# EAGLE board csa-ultrabus-1.0a (EAGLE 6.4), part 1 of 2
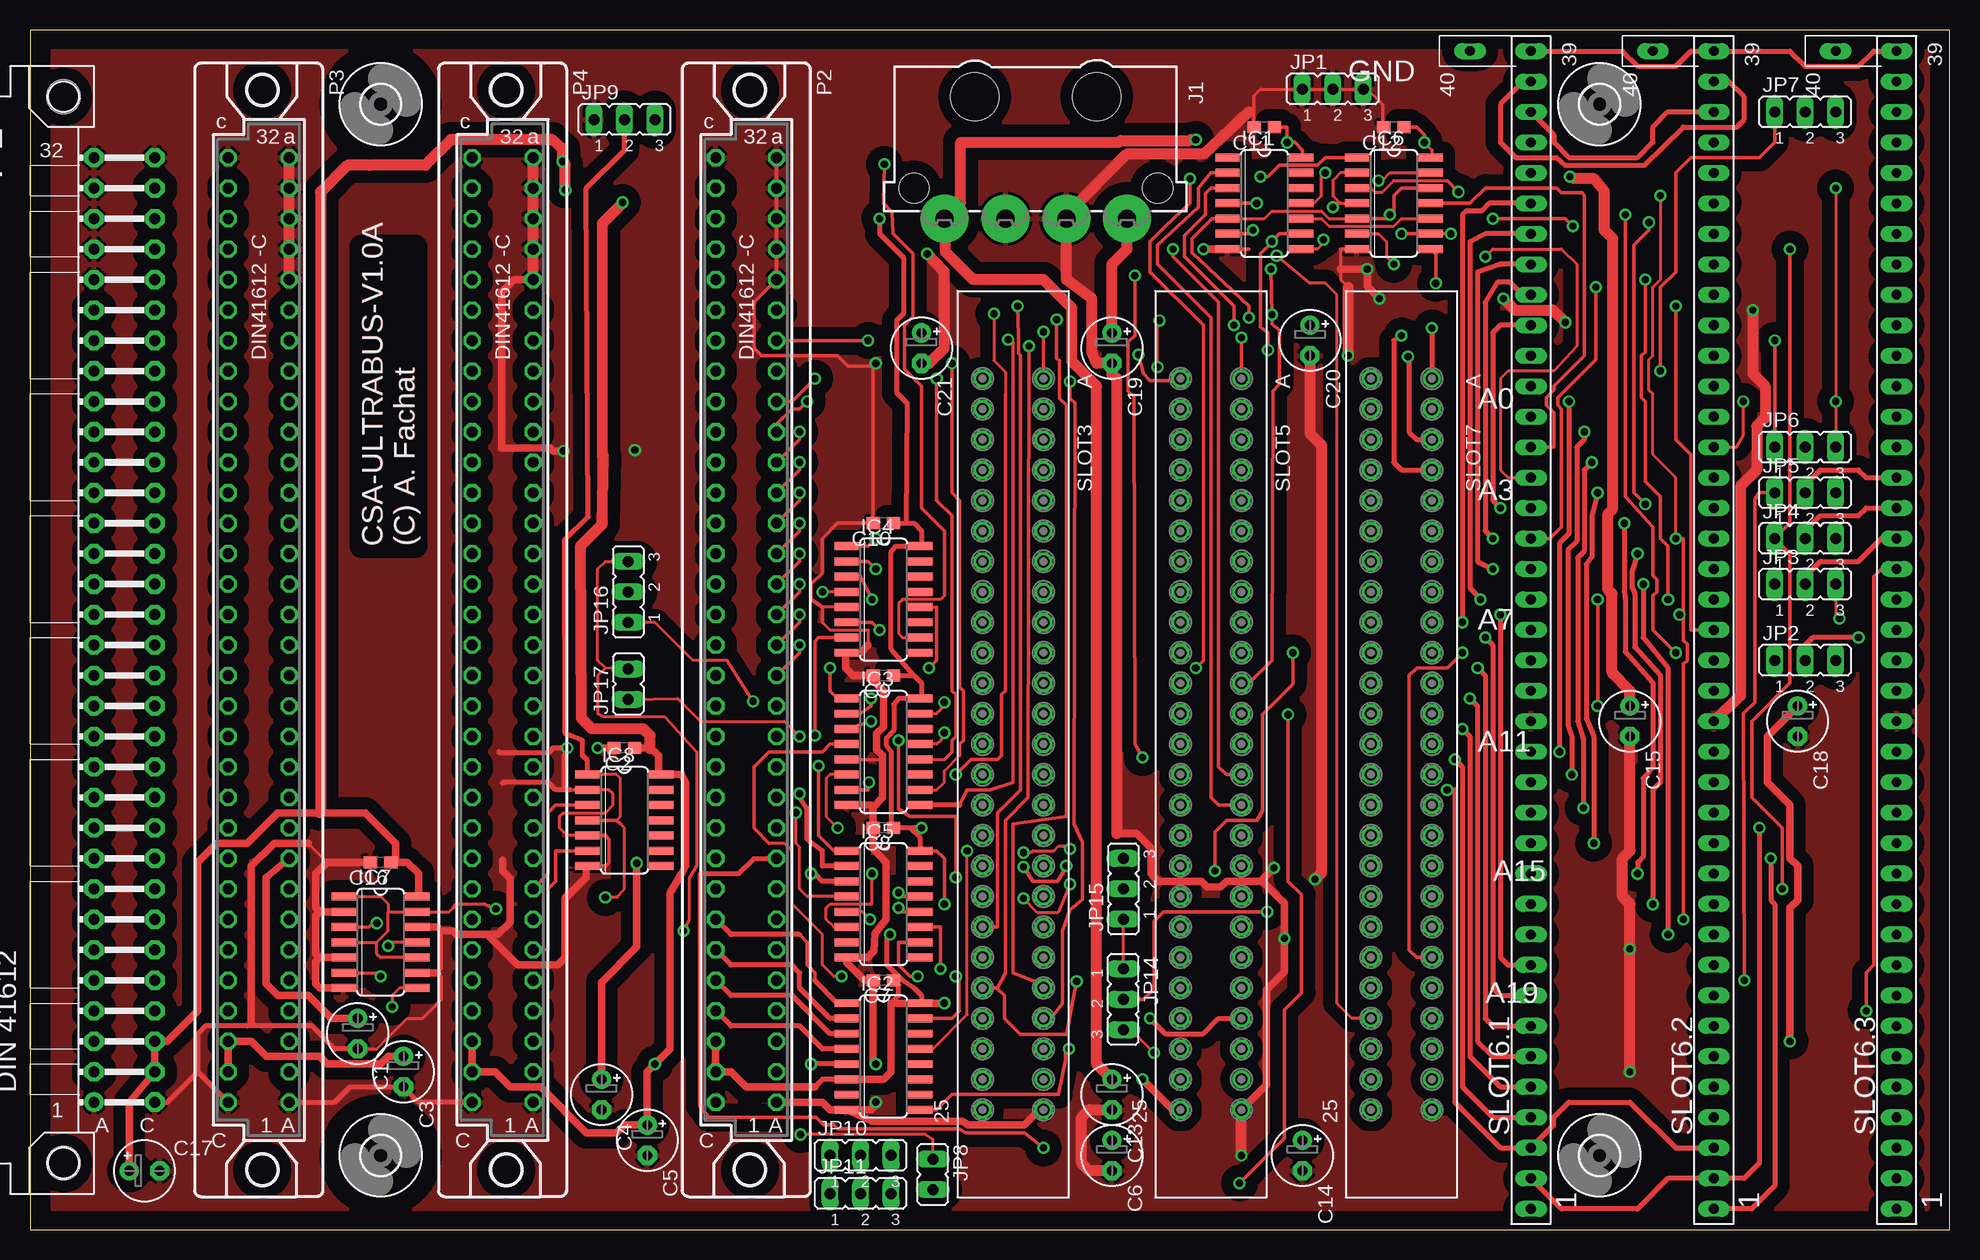
[diagram p3: board, top side]
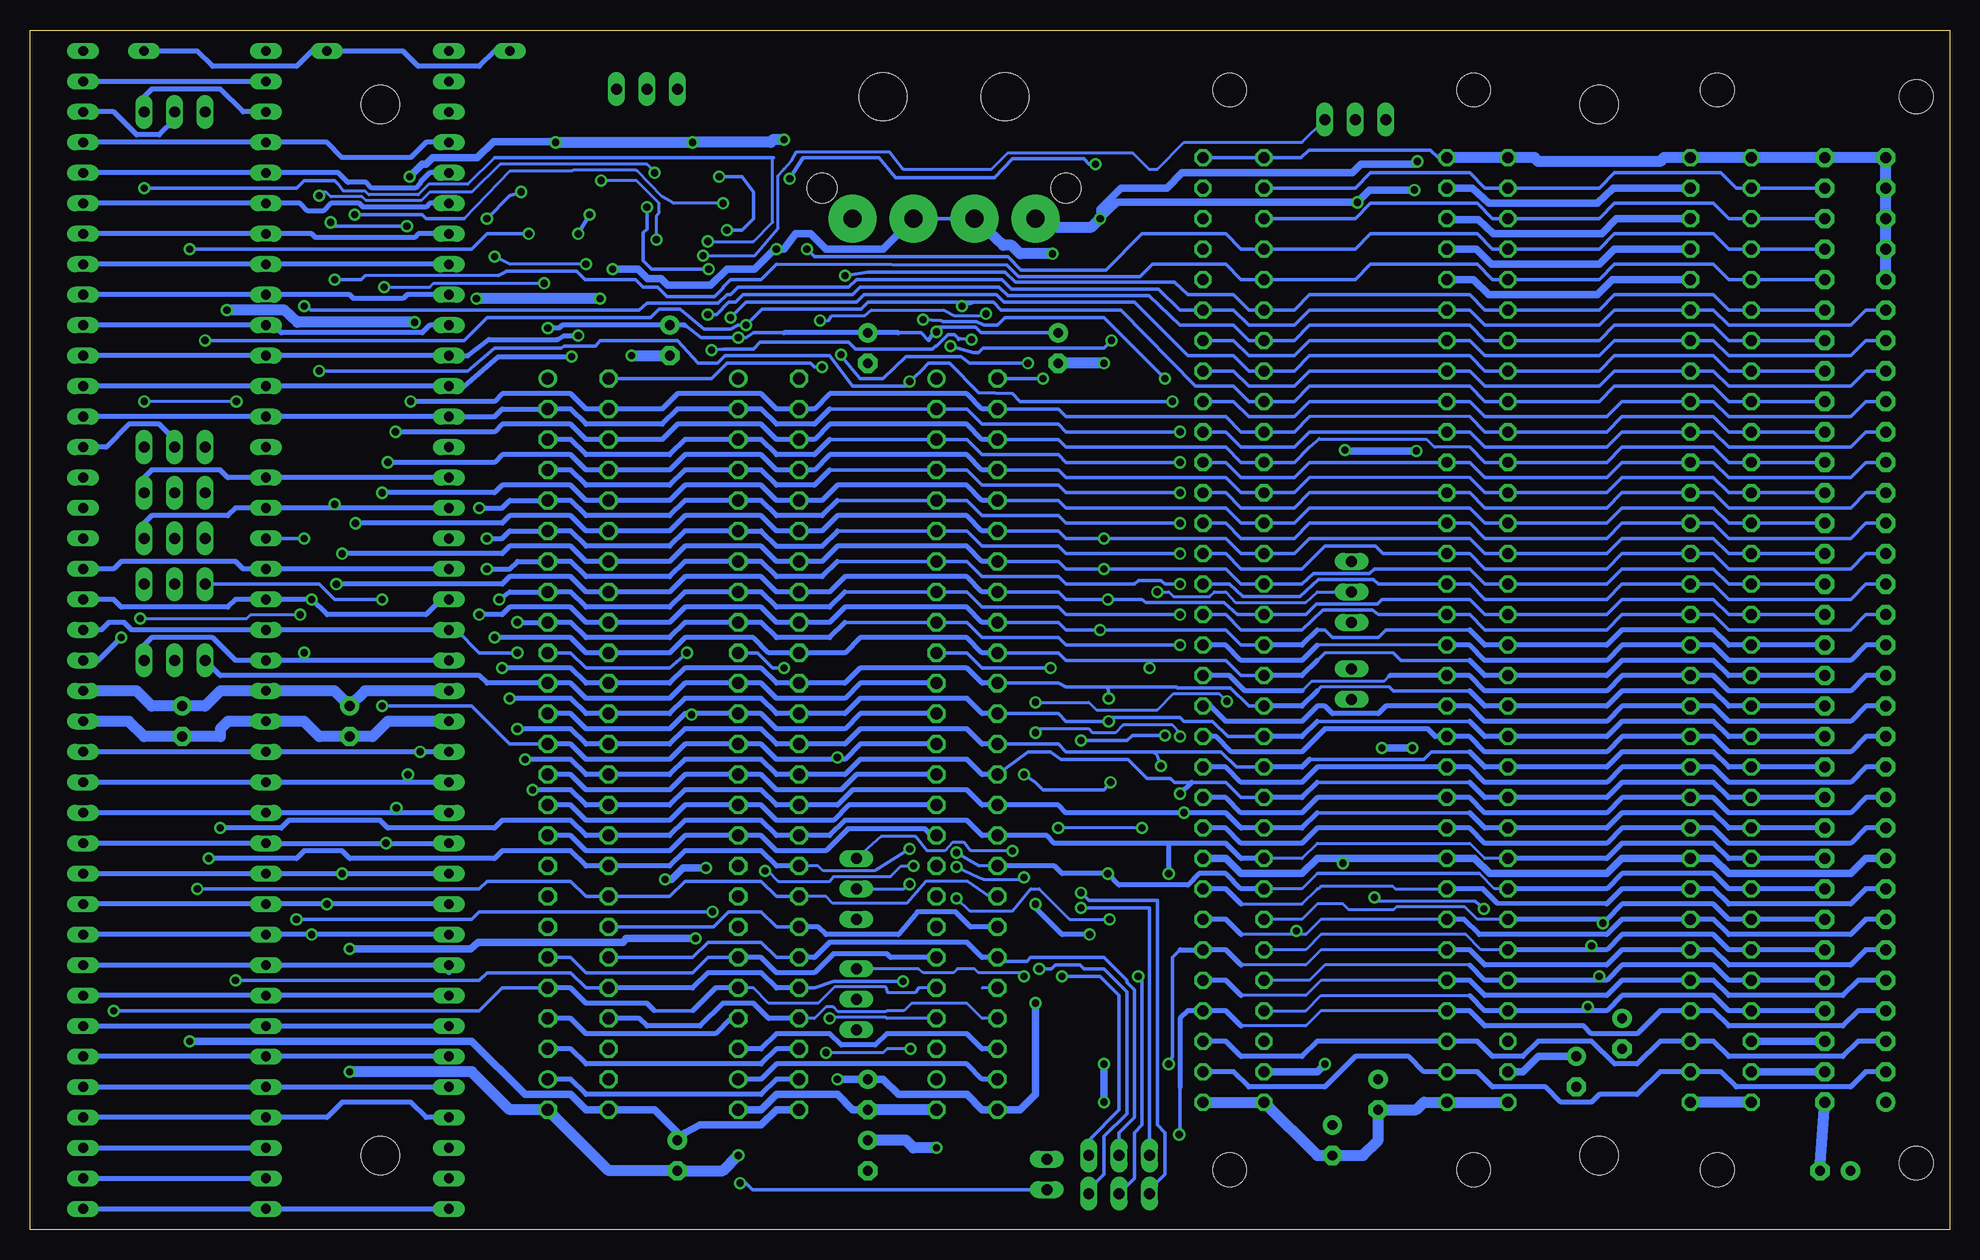
[diagram p4: board, bottom side, seen from below]

Size 160.02 x 100.03 mm. Coordinates in mm from the lower left corner, seen from the top.
Outline: 0.02,0.01 160.02,0.01 160.02,100.01 0.02,100.01 0.02,0.01
Copper layers (1*16): Top 0.035mm / dielectric 1.5mm / Bottom 0.035mm
Design rules "default *": minimum track width 10mil, minimum drill 20mil, track to track 6mil, track to pad 6mil, pad to pad 6mil, via to via 6mil, smd to smd 6mil, copper to edge 40mil, drill to drill 8mil, minimum pad ring 10mil, minimum via ring 8mil, stop-mask expansion 4mil, vias tented up to drill 0mil, thermal gap 10mil

## Footprints (pad centres in the part's own frame; a part is rotated, then mirrored left to right if it is on the bottom)
E2,5-5 = drill 0.813 pad 1.6: + -1.27,0 | drill 0.813 pad 1.6 octagon: - 1.27,0
C0603 = smd 1.1 x 1: 1 -0.85,0; 2 0.85,0
3,2 = hole 3.2: 0,0
SO14 = smd 0.66 x 2.032: 1 -3.81,-3.073; 2 -2.54,-3.073; 3 -1.27,-3.073; 4 0,-3.073; 5 1.27,-3.073; 6 2.54,-3.073; 7 3.81,-3.073; 8 3.81,3.073; 9 2.54,3.073; 10 1.27,3.073; 11 0,3.073; 12 -1.27,3.073; 13 -2.54,3.073; 14 -3.81,3.073
SO16 = smd 0.66 x 2.032: 1 -4.445,-3.073; 2 -3.175,-3.073; 3 -1.905,-3.073; 4 -0.635,-3.073; 5 0.635,-3.073; 6 1.905,-3.073; 7 3.175,-3.073; 8 4.445,-3.073; 9 4.445,3.073; 10 3.175,3.073; 11 1.905,3.073; 12 0.635,3.073; 13 -0.635,3.073; 14 -1.905,3.073; 15 -3.175,3.073; 16 -4.445,3.073
827001 = drill 1.5 pad 4: 1 -7.62,0; 2 -2.54,0; 3 2.54,0; 4 7.62,0 | hole 4: 5.08,-10.16; -5.08,-10.16 | hole 2.5: 10.16,-2.54; -10.16,-2.54
JP2 = drill 0.914 long: 1 -2.54,0; 2 0,0; 3 2.54,0
JP1 = drill 0.914 long: 1 0,-1.27; 2 0,1.27
CSABUS = drill 0.914 pad 1.6: A1 7.62,36.83 | drill 0.914 pad 1.6 octagon: A2 7.62,34.29; A3 7.62,31.75; A4 7.62,29.21; A5 7.62,26.67; A6 7.62,24.13; A7 7.62,21.59; A8 7.62,19.05; A9 7.62,16.51; A10 7.62,13.97; A11 7.62,11.43; A12 7.62,8.89; A13 7.62,6.35; A14 7.62,3.81; A15 7.62,1.27; A16 7.62,-1.27; A17 7.62,-3.81; A18 7.62,-6.35; A19 7.62,-8.89; A20 7.62,-11.43; A21 7.62,-13.97; A22 7.62,-16.51; A23 7.62,-19.05; A24 7.62,-21.59; A25 7.62,-24.13; A26 7.62,-26.67; A27 7.62,-29.21; A28 7.62,-31.75; A29 7.62,-34.29; A30 7.62,-36.83; A31 7.62,-39.37; A32 7.62,-41.91; C1 2.54,36.83; C2 2.54,34.29; C3 2.54,31.75; C4 2.54,29.21; C5 2.54,26.67; C6 2.54,24.13; C7 2.54,21.59; C8 2.54,19.05; C9 2.54,16.51; C10 2.54,13.97; C11 2.54,11.43; C12 2.54,8.89; C13 2.54,6.35; C14 2.54,3.81; C15 2.54,1.27; C16 2.54,-1.27; C17 2.54,-3.81; C18 2.54,-6.35; C19 2.54,-8.89; C20 2.54,-11.43; C21 2.54,-13.97; C22 2.54,-16.51; C23 2.54,-19.05; C24 2.54,-21.59; C25 2.54,-24.13; C26 2.54,-26.67; C27 2.54,-29.21; C28 2.54,-31.75; C29 2.54,-34.29; C30 2.54,-36.83; C31 2.54,-39.37; C32 2.54,-41.91 | hole 2.794: 10.16,41.91; 10.16,-46.99
CSABUSSOCK180 = drill 0.914 octagon: A1 -2.54,41.91; A2 -2.54,39.37; A3 -2.54,36.83; A4 -2.54,34.29; A5 -2.54,31.75; A6 -2.54,29.21; A7 -2.54,26.67; A8 -2.54,24.13; A9 -2.54,21.59; A10 -2.54,19.05; A11 -2.54,16.51; A12 -2.54,13.97; A13 -2.54,11.43; A14 -2.54,8.89; A15 -2.54,6.35; A16 -2.54,3.81; A17 -2.54,1.27; A18 -2.54,-1.27; A19 -2.54,-3.81; A20 -2.54,-6.35; A21 -2.54,-8.89; A22 -2.54,-11.43; A23 -2.54,-13.97; A24 -2.54,-16.51; A25 -2.54,-19.05; A26 -2.54,-21.59; A27 -2.54,-24.13; A28 -2.54,-26.67; A29 -2.54,-29.21; A30 -2.54,-31.75; A31 -2.54,-34.29; A32 -2.54,-36.83; C1 2.54,41.91; C2 2.54,39.37; C3 2.54,36.83; C4 2.54,34.29; C5 2.54,31.75; C6 2.54,29.21; C7 2.54,26.67; C8 2.54,24.13; C9 2.54,21.59; C10 2.54,19.05; C11 2.54,16.51; C12 2.54,13.97; C13 2.54,11.43; C14 2.54,8.89; C15 2.54,6.35; C16 2.54,3.81; C17 2.54,1.27; C18 2.54,-1.27; C19 2.54,-3.81; C20 2.54,-6.35; C21 2.54,-8.89; C22 2.54,-11.43; C23 2.54,-13.97; C24 2.54,-16.51; C25 2.54,-19.05; C26 2.54,-21.59; C27 2.54,-24.13; C28 2.54,-26.67; C29 2.54,-29.21; C30 2.54,-31.75; C31 2.54,-34.29; C32 2.54,-36.83 | hole 2.794: -0.305,47.549; -0.305,-42.469
FE100-25 = drill 1 octagon: 1 -29.21,-2.54; 2 -26.67,-2.54; 3 -24.13,-2.54; 4 -21.59,-2.54; 5 -19.05,-2.54; 6 -16.51,-2.54; 7 -13.97,-2.54; 8 -11.43,-2.54; 9 -8.89,-2.54; 10 -6.35,-2.54; 11 -3.81,-2.54; 12 -1.27,-2.54; 13 1.27,-2.54; 14 3.81,-2.54; 15 6.35,-2.54; 16 8.89,-2.54; 17 11.43,-2.54; 18 13.97,-2.54; 19 16.51,-2.54; 20 19.05,-2.54; 21 21.59,-2.54; 22 24.13,-2.54; 23 26.67,-2.54; 24 29.21,-2.54; 25 31.75,-2.54; B -26.67,2.54; C -24.13,2.54; D -21.59,2.54; E -19.05,2.54; F -16.51,2.54; G -13.97,2.54; H -11.43,2.54; J -8.89,2.54; K -6.35,2.54; L -3.81,2.54; M -1.27,2.54; N 1.27,2.54; O 3.81,2.54; P 6.35,2.54; Q 8.89,2.54; R 11.43,2.54; S 13.97,2.54; T 16.51,2.54; U 19.05,2.54; V 21.59,2.54; W 24.13,2.54; X 26.67,2.54; Z 31.75,2.54 | drill 1: A -29.21,2.54; Y 29.21,2.54
SIL39+1R = drill 0.813 long: 1 -21.59,0; 2 -19.05,0; 3 -16.51,0; 4 -13.97,0; 5 -11.43,0; 6 -8.89,0; 7 -6.35,0; 8 -3.81,0; 9 -1.27,0; 10 1.27,0; 11 3.81,0; 12 6.35,0; 13 8.89,0; 14 11.43,0; 15 13.97,0; 16 16.51,0; 17 19.05,0; 18 21.59,0; 19 24.13,0; 20 26.67,0; 21 29.21,0; 22 31.75,0; 23 34.29,0; 24 36.83,0; 25 39.37,0; 26 41.91,0; 27 44.45,0; 28 46.99,0; 29 49.53,0; 30 52.07,0; 31 54.61,0; 32 57.15,0; 33 59.69,0; 34 62.23,0; 35 64.77,0; 36 67.31,0; 37 69.85,0; 38 72.39,0; 39 74.93,0; 40 74.93,5.08

## Placement (x,y rotation side)
C1  47u  [E2,5-5]  27.32,16.36 270 top
C2  [C0603]  49.55,40.17 180 top
C3  47u  [E2,5-5]  31.13,13.18 270 top
C4  47u  [E2,5-5]  47.64,11.28 270 top
C5  47u  [E2,5-5]  51.45,7.47 270 top
C6  47u  [E2,5-5]  90.19,6.2 270 top
C7  [C0603]  71.14,20.8 180 top
C8  [C0603]  71.14,33.5 180 top
C9  [C0603]  71.14,46.2 180 top
C10  [C0603]  71.14,58.9 180 top
C11  [C0603]  102.89,91.92 180 top
C12  [C0603]  113.68,91.92 180 top
C13  47u  [E2,5-5]  90.19,11.28 270 top
C14  47u  [E2,5-5]  106.06,6.2 270 top
C15  47u  [E2,5-5]  133.37,42.39 270 top
C16  [C0603]  29.23,30.65 180 top
C17  47u  [E2,5-5]  9.54,4.93 0 top
C18  47u  [E2,5-5]  147.34,42.39 270 top
C19  47u  [E2,5-5]  90.19,73.51 270 top
C20  47u  [E2,5-5]  106.7,74.14 270 top
C21  47u  [E2,5-5]  74.31,73.51 270 top
H1  MOUNT-HOLE3.2  [3,2]  29.23,93.83 0 top
H2  MOUNT-HOLE3.2  [3,2]  29.23,6.2 0 top
H3  MOUNT-HOLE3.2  [3,2]  130.83,93.83 0 top
H4  MOUNT-HOLE3.2  [3,2]  130.83,6.2 0 top
IC1  74AC04D  [SO14]  102.89,85.57 270 top
IC2  74AC138D  [SO16]  71.14,14.45 270 top
IC3  74AC138D  [SO16]  71.14,39.85 270 top
IC4  74AC138D  [SO16]  71.14,52.55 270 top
IC5  74AC138D  [SO16]  71.14,27.15 270 top
IC6  74HCT00D  [SO14]  113.68,85.57 270 top
IC7  74HCT125D  [SO14]  29.23,23.98 270 top
IC8  74HCT125D  [SO14]  49.55,34.14 270 top
J1  [827001]  83.84,84.3 180 top
JP1  [JP2]  108.6,95.1 0 top
JP2  [JP2]  147.97,47.47 0 top
JP3  [JP2]  147.97,53.82 0 top
JP4  [JP2]  147.97,57.63 0 top
JP5  [JP2]  147.97,61.44 0 top
JP6  [JP2]  147.97,65.25 0 top
JP7  [JP2]  147.97,93.19 0 top
JP8  [JP1]  75.26,4.61 180 top
JP9  [JP2]  49.55,92.56 0 top
JP10  [JP2]  69.23,6.2 0 top
JP11  [JP2]  69.23,3.02 0 top
JP14  [JP2]  91.14,19.22 270 top
JP15  [JP2]  91.14,28.42 90 top
JP16  [JP2]  49.86,53.19 90 top
JP17  [JP1]  49.86,45.49 0 top
P1  CSABUS  [CSABUS]  12.95,47.47 180 top
P2  CSABUSSOCK180  [CSABUSSOCK180]  59.71,52.55 180 top
P3  CSABUSSOCK180  [CSABUSSOCK180]  19.07,52.55 180 top
P4  CSABUSSOCK180  [CSABUSSOCK180]  39.39,52.55 180 top
SLOT3  A2SLOT  [FE100-25]  81.93,41.76 270 top
SLOT5  A2SLOT  [FE100-25]  98.44,41.76 270 top
SLOT6.1  RC2014/650239+1R  [SIL39+1R]  125.11,23.34 90 top
SLOT6.2  RC2014/650239+1R  [SIL39+1R]  140.35,23.34 90 top
SLOT6.3  RC2014/650239+1R  [SIL39+1R]  155.59,23.34 90 top
SLOT7  A2SLOT  [FE100-25]  114.32,41.76 270 top

## Tracks (layer width: path | path; a pad name or v marks a point on that pad's centre or on a via)
8MHZ
  Top 0.305: IC1.2 98.44,88.11 97.41,86.84 97.41,85.25 94,82.08 94,80.49 98.44,76.05 98.44,36.04 99.08,35.41 SLOT5.P
  Bottom 0.406: SLOT3.P 91.77,35.41 93.04,34.14 97.81,34.14 99.08,35.41 SLOT5.P 105.43,35.41 106.7,34.14 113.68,34.14 114.95,35.41 SLOT7.P
8PHI2
  Bottom 0.305: P1.C31 P3.C31 17.8,86.84 19.07,88.11 27.96,88.11 29.23,86.84 P4.C31 38.75,86.84 40.02,88.11 48.28,88.11 49.55,86.84 P2.C31
12V  (via drill 0.6)
  Top 0.305: v100.98,74.38 SLOT5.A | SLOT3.A v84.47,74.86
  Top 0.406: v116.86,75.17 SLOT7.A
  Top 0.914: C19.+ 90.19,80.49 91.46,81.76 J1.1
  Bottom 0.305: C21.+ 80.74,74.78 81.22,75.25 84.47,75.25 | 97.17,74.78 99.71,74.78 100.35,74.38 v100.98,74.38 104.08,74.38 105.43,75.41 | 84.47,75.25 85.11,74.14 85.74,74.78 87.65,74.78 | v84.47,74.86 84.47,75.25
  Bottom 0.406: 87.65,74.78 C19.+ 97.17,74.78 | 105.43,75.41 C20.+ 115.66,75.41 115.9,75.17 v116.86,75.17
16MHZ
  Bottom 0.305: P1.C30 P3.C30 18.43,84.3 19.7,85.57 27.96,85.57 29.23,84.3 P4.C30 38.12,84.3 39.39,85.57 48.28,85.57 49.55,84.3 P2.C30
50HZ
  Bottom 0.406: P1.A3 7.64,15.72 8.91,14.45 18.43,14.45 19.7,15.72 P3.A3 24.15,15.72 26.05,13.82 27.96,13.82 29.86,15.72 34.31,15.72 35.58,14.45 38.12,14.45 39.39,15.72 P4.A3 52.72,15.72 53.99,14.45 59.07,14.45 60.34,15.72 P2.A3
/BANK0  (via drill 0.6)
  Top 0.254: 77.49,18.26 77.49,20.8 v77.17,21.12 | JP14.1 JP15.1
  Top 0.305: IC2.15 76.85,17.63 77.49,18.26
  Bottom 0.254: v77.17,21.12 77.49,21.44 80.98,21.44 81.3,21.76 82.72,21.76 83.04,21.44 85.58,21.44 85.98,21.76 JP14.1
/BANK2  (via drill 0.6)
  Top 0.254: IC2.13 75.26,15.09 78.12,17.94 v78.12,31.6
  Bottom 0.254: v78.12,31.6 81.61,31.6 82.17,32.31 83.12,32.31 83.76,31.6 85.26,31.6 86.22,32.79 89.07,32.79 90.19,31.84 JP15.3
/BANK4_Q  (via drill 0.6)
  Top 0.305: SLOT6.1.23 126.7,57.63 127.65,58.58 127.65,68.43 127.33,68.75 127.33,69.38 130.51,72.56 v130.51,78.59 | v117.17,78.9 117.17,81.34 IC6.8
  Bottom 0.254: v130.51,78.59 126.7,78.59 126.38,78.9 v117.17,78.9
/BANK6  (via drill 0.6)
  Top 0.254: v93.68,14.77 91.77,16.67 JP14.3
  Top 0.305: IC2.9 75.58,10.01 76.85,11.28 85.74,11.28 86.3,14.13 86.3,14.77 v86.61,15.09
  Bottom 0.254: v86.61,15.09 88.6,15.09 88.92,14.77 v93.68,14.77
/BE
  Top 0.305: P4.A8 43.2,29.69 43.2,34.77 43.83,35.41 IC8.3
  Bottom 0.254: 59.07,27.15 53.99,27.15 52.72,28.42 52.56,28.5 52.4,28.66 46.45,28.66 46.21,28.42 P4.A8
  Bottom 0.406: P1.A8 7,28.42 8.27,27.15 18.43,27.15 19.7,28.42 P3.A8 27.32,28.42 28.59,27.15 37.72,27.23 38.91,28.42 P4.A8 | 59.07,27.15 60.34,28.42 P2.A8
/DMA  (via drill 0.6)
  Top 0.254: SLOT7.22 110.19,17.63 108.92,18.9 108.92,77.95 107.97,78.9 106.7,78.9 v103.92,81.21
  Bottom 0.254: SLOT3.22 80.66,17.63 81.93,18.9 86.53,18.9 87.17,18.26 88.6,18.26 88.68,18.18 92.65,18.18 93.04,18.58 93.68,18.58 94.63,17.63 SLOT5.22 | v103.92,81.21 99.63,81.21 97.65,83.51 97.65,87.87 97.17,88.43 96.54,89.14 96.14,89.86 88.36,89.86 87.25,88.43 79.87,88.43 78.52,89.78 68.12,89.78 66.77,88.43 66.06,88.43 63.83,90.65 53.99,90.65 JP9.3
  Bottom 0.406: SLOT5.22 98.44,17.63 99.71,18.9 102.25,18.9 104.16,16.99 108.6,16.99 109.24,17.63 SLOT7.22
/EXTIO
  Bottom 0.254: P4.A5 52.4,20.8 53.67,19.53 59.07,19.53
  Bottom 0.406: P1.A5 7.64,20.8 8.91,19.53 18.43,19.53 19.7,20.8 P3.A5 27.32,20.8 28.59,19.53 38.75,19.53 40.02,20.8 P4.A5 | 59.07,19.53 60.34,20.8 P2.A5
/IOINH  (via drill 0.6)
  Top 0.254: JP8.1 75.26,7.55 74.63,7.94 v64.23,7.94
  Bottom 0.254: P4.A4 52.4,18.26 53.67,16.99 59.07,16.99 | v64.23,7.94 64.31,7.86 64.15,7.71
  Bottom 0.305: 64.15,11.91 64.15,7.71
  Bottom 0.406: P1.A4 7.64,18.26 8.91,16.99 18.43,16.99 19.7,18.26 P3.A4 24.15,18.26 26.05,16.36 29.86,16.36 30.5,16.99 38.75,16.99 40.02,18.26 P4.A4 | 59.07,16.99 60.34,18.26 P2.A4 63.52,18.26 64.15,17.63 64.15,11.91
/IOSEL  (via drill 0.6)
  Top 0.254: 47.96,46.84 47.32,47.47 47.32,55.09 47.96,55.73 JP16.3 | JP17.2 47.96,46.84 | 47.96,46.84 47.32,46.2 47.32,43.03 47.8,42.79 52.88,42.79 55.58,39.85 55.58,30.33 54.94,29.3 54.94,25.88 v54.47,24.93
  Bottom 0.254: P4.A7 52.4,25.88 53.67,24.61 54.55,24.61 | 54.55,24.61 59.07,24.61 | v54.47,24.93 54.55,24.61
  Bottom 0.406: P1.A7 7,25.88 8.27,24.61 18.43,24.61 19.7,25.88 P3.A7 27.32,25.88 28.59,24.61 39.23,24.61 40.5,25.88 P4.A7 | 59.07,24.61 60.34,25.88 P2.A7
/IOSTROBE
  Bottom 0.305: SLOT5.20 97.81,22.71 99.08,23.98 103.52,23.98 104.79,22.71 SLOT7.20 | JP10.2 69.23,8.1 67.96,9.37 67.96,20.01 68.6,20.64 68.6,20.8 70.5,22.71 76.61,22.71 76.93,22.39 79.07,22.39 SLOT3.20
  Bottom 0.406: SLOT3.20 80.66,22.71 81.93,23.98 93.36,23.98 94.63,22.71 SLOT5.20
/IRQ  (via drill 0.6)
  Top 0.305: SLOT3.V 85.11,20.17 81.93,21.44 81.93,33.82 86.38,34.45 86.38,68.75 85.82,69.3 85.82,72.48 85.58,72.63 v85.58,75.89 | P2.A24 63.52,69.06 v65.42,70.97 | v153.05,18.26 153.05,21.44 153.69,22.07 153.69,54.46 154.32,55.09 SLOT6.3.22
  Bottom 0.254: SLOT3.V 85.98,20.17 86.22,19.77 88.52,19.77 88.68,20.25 92.96,20.25 94.31,18.9 98.44,18.9 99.71,20.17 SLOT5.V
  Bottom 0.305: P1.A24 7,69.06 8.27,67.79 18.43,67.79 19.7,69.06 P3.A24 27.32,69.06 28.59,67.79 38.75,67.79 40.02,69.06 P4.A24 53.36,69.06 54.63,67.79 58.44,67.79 59.71,69.06 P2.A24 | 104.79,18.26 107.97,18.26 | v65.42,70.97 70.5,76.05 78.76,76.05 79.39,75.41 80.5,75.41 81.14,75.73 83.91,75.73 84.07,75.81 v85.58,75.89 | SLOT7.V 120.67,20.17 122.57,18.26 v153.05,18.26
  Bottom 0.406: SLOT5.V 102.89,20.17 104.79,18.26 | 107.97,18.26 108.6,18.9 113.68,18.9 114.95,20.17 SLOT7.V | SLOT6.1.22 SLOT6.2.22 142.26,55.09 142.89,55.73 152.42,55.73 153.05,55.09 SLOT6.3.22
/M1  (via drill 0.6)
  Top 0.305: IC1.4 v102.25,85.57 | v132.97,84.62 132.97,61.12 135.27,58.58 135.27,54.54 135.59,54.22 135.59,53.19 135.27,52.87 135.27,50.01 v137.18,48.11
  Bottom 0.254: v102.25,85.57 106.38,85.57 107.33,86.13 109.39,88.27 109.55,88.35 114.71,88.35 114.87,88.27 120.03,88.27 123.84,84.3
  Bottom 0.305: 123.84,84.3 127.02,84.3 127.33,84.62 v132.97,84.62 | v137.18,48.11 137.18,47.47
  Bottom 0.406: SLOT6.1.19 137.18,47.47 SLOT6.2.19 142.89,47.47 144.8,49.38 149.88,49.38 150.51,48.74 JP2.3
/MEMSEL  (via drill 0.6)
  Top 0.254: 43.2,23.34 P4.A6
  Top 0.305: 43.2,23.34 43.2,28.42 43.83,29.06 43.83,31.6 IC8.6
  Top 0.406: IC2.5 v65.1,13.82
  Bottom 0.254: P4.A6 52.4,23.34 53.67,22.07 59.07,22.07
  Bottom 0.305: 64.15,23.34 64.79,22.71 64.79,14.45 v65.1,13.82
  Bottom 0.406: P1.A6 7,23.34 8.27,22.07 18.43,22.07 19.7,23.34 P3.A6 27.32,23.34 28.59,22.07 38.75,22.07 40.02,23.34 P4.A6 | 59.07,22.07 60.34,23.34 P2.A6 64.15,23.34
/NMI  (via drill 0.6)
  Top 0.305: SLOT3.W 85.11,17.63 86.06,18.9 86.06,24.93 86.69,26.68 87.72,27.55 87.72,32.31 87.01,33.82 87.09,68.9 86.69,69.3 v86.69,70.73 | P2.A23 62.25,67.16 63.52,68.43 64.15,68.43 v64.79,69.06 | JP7.1 145.43,90.65 144.16,89.38 138.45,89.38 137.18,88.11 137.18,79.86 135.91,78.59 v135.91,71.6
  Top 0.406: v93.36,17.63 94.63,16.36 97.81,16.36 99.08,17.63 SLOT5.W
  Bottom 0.254: SLOT3.W 88.6,17.63 88.68,17.71 93.2,17.71 93.28,17.63 v93.36,17.63
  Bottom 0.305: P1.A23 7,66.52 8.27,65.25 18.43,65.25 19.7,66.52 P3.A23 27.32,66.52 28.59,65.25 38.75,65.25 40.02,66.52 P4.A23 53.36,66.52 54.63,65.25 59.07,65.25 60.34,66.52 P2.A23 | v64.79,69.06 77.49,69.06 78.12,69.7 80.98,69.78 83.36,72.24 85.11,72.24 85.74,71.6 v86.69,70.73 87.01,70.33 91.46,70.33 93.36,72.87 102.09,72.87 102.73,72.24 104.31,72.24 106.06,74.14 112.49,74.14 112.89,73.67 115.51,73.67 115.74,73.51 121.3,73.51 123.52,71.6 v135.91,71.6
  Bottom 0.406: SLOT5.W 101.62,17.63 102.89,16.36 113.68,16.36 114.95,17.63 SLOT7.W
/RD0  (via drill 0.6)
  Top 0.254: IC6.6 112.41,83.03 113.05,82.4 113.05,81.13 v113.68,80.49 | v121.3,81.13 121.94,81.76 127.65,81.76 128.92,80.49 128.92,73.67 127.02,71.6 123.21,71.6 122.57,70.97 122.57,63.35 123.21,62.71 SLOT6.1.25
  Bottom 0.254: v113.68,80.49 120.03,80.49 v121.3,81.13
  Bottom 0.406: SLOT6.1.25 SLOT6.2.25 143.53,62.71 144.16,63.35 149.88,63.35 150.51,62.71 JP5.3
/RES  (via drill 0.6)
  Top 0.305: v137.18,77 137.18,65.89 138.45,64.62 138.45,50.01 SLOT6.2.20 | SLOT7.U 115.59,22.71 114.95,23.34 114.95,46.2 115.59,46.84 118.13,46.84 v119.4,48.11
  Bottom 0.305: P1.A27 7,76.68 8.27,75.41 18.43,75.41 19.7,76.68 P3.A27 27.96,76.68 29.23,75.41 38.75,75.41 40.02,76.68 P4.A27 53.36,76.68 54.63,75.41 58.44,75.41 59.71,76.68 P2.A27 64.15,76.68 65.98,78.43 78.2,78.43 78.99,79.22 91.14,79.22 91.77,78.59 100.98,78.59 101.62,77.95 101.93,77.95 102.65,77.24 108.6,77.24 109.24,76.68 136.62,76.68 136.94,77 v137.18,77 | SLOT5.U 103.52,22.71 104.79,21.44 113.68,21.44 114.95,22.71 SLOT7.U | v119.4,48.11 122.57,48.11 124.48,50.01 SLOT6.1.20
  Bottom 0.406: SLOT3.U 88.28,22.71 88.6,23.03 93.04,23.03 94.63,21.44 97.81,21.44 99.08,22.71 SLOT5.U | SLOT6.1.20 SLOT6.2.20 151.54,50.01 152.18,50.65 153.45,50.65 154.08,50.01 SLOT6.3.20
/SEL6  (via drill 0.6)
  Top 0.254: JP3.3 150.51,51.28 v150.83,50.97 | v137.49,51.28 137.81,51.28 | v137.18,57.63 137.18,62.71 135.27,64.62 135.27,69.7 134.95,70.01 134.95,72.56 135.27,72.87 135.27,78.59 135.91,79.22 v135.91,86.21 | IC1.11 107.01,85.57 107.65,86.21 107.65,87.79 v107.97,88.11
  Top 0.305: v103.12,26.52 94.47,26.52 93.68,25.72 93.68,20.09 92.8,19.22 JP14.2 | v137.81,25.88 137.81,47.15 138.13,47.47 138.13,48.82 137.81,49.14 137.81,51.28 137.81,57.63 v137.18,57.63
  Bottom 0.254: v150.83,50.97 141.94,50.97 141.62,51.28 v137.49,51.28 | v107.97,88.11 107.97,88.19 108.6,88.83 120.82,88.83 123.21,86.53 126.7,86.53 127.41,85.81 132.02,85.81 132.33,86.13 134.95,86.13 135.35,86.53 135.59,86.53 v135.91,86.21
  Bottom 0.305: v103.12,26.52 122.57,26.52 123.21,25.88 v137.81,25.88 | v137.18,57.63 SLOT6.2.23
/SLOT0IO  (via drill 0.6)
  Top 0.254: IC3.15 75.58,43.03 75.9,43.34 v76.22,43.98 | v60.26,44.06 58.12,47.47 55.26,47.47 52.09,50.65 JP16.1
  Bottom 0.254: v76.22,43.98 71.77,43.98 71.14,43.34 66.06,43.34 64.71,44.69 60.9,44.69 v60.26,44.06
/SLOT2IO  (via drill 0.6)
  Top 0.254: JP17.1 53.99,44.3 55.9,42.39 62.88,42.39 v64.15,41.12 | v76.22,41.44 75.9,40.8 75.58,40.49 IC3.13
  Bottom 0.254: v64.15,41.12 64.15,41.44 64.79,42.08 68.91,42.08 69.55,41.44 71.45,41.44 71.77,41.76 75.9,41.76 v76.22,41.44
/SLOT3IO  (via drill 0.6)
  Top 0.254: IC3.12 76.22,39.22
  Top 0.305: 76.22,39.22 76.85,39.85 76.85,40.8 77.17,41.12 77.17,44.62 76.85,44.93 76.85,59.54 75.58,60.81 v75.58,70.97
  Bottom 0.305: v75.58,70.97 SLOT3.1
/SLOT4IO_Q
  Top 0.305: IC6.11 120.03,85.57 121.3,86.84 127.25,86.84 127.65,86.45 129.4,86.45 129.56,86.21 129.56,72.87 127.02,70.33 127.02,70.01 126.38,69.38 126.38,68.75 127.02,68.11 127.02,65.25 SLOT6.1.26
/SLOT5IO  (via drill 0.6)
  Top 0.254: IC3.10 75.58,36.68 76.22,37.31 76.22,38.26 77.49,39.54
  Top 0.305: 77.49,39.54 77.49,40.49 77.8,40.8 77.8,44.93 77.49,45.25 77.49,60.81 76.85,61.44 v76.85,72.24 | v92.41,72.95 92.8,71.36 93.36,70.81 95.82,70.81 95.9,70.89 SLOT5.1
  Bottom 0.305: v76.85,72.24 81.69,72.24 82.41,72.79 87.01,72.79 88.92,70.97 90.82,70.97 92.09,72.48 v92.41,72.95
/SLOT6IO  (via drill 0.6)
  Top 0.254: SLOT6.2.26 142.26,65.25 142.81,66.2 v142.81,69.06 | JP6.3 v150.51,69.06 v150.51,86.84
  Top 0.305: 77.49,35.41 78.12,36.68 80.03,36.68 81.93,37.31 81.93,73.98 81.61,73.9 v81.53,74.22 | IC1.9 104.16,83.03 v103.52,82.4 103.6,82.32 103.6,82.4 102.57,81.37 102.57,75.25 103.2,74.78 v103.2,73.35
  Top 0.406: 77.49,35.41 IC3.9
  Bottom 0.254: 121.3,89.38 123.52,87.16 126.78,87.16 127.65,86.29 131.78,86.29 132.1,86.6 133.92,86.6 134.32,87.16 | v142.81,69.06 v150.51,69.06 | v103.52,82.4 99.71,82.4 98.12,83.98 98.12,89.38
  Bottom 0.305: 98.04,89.38 98.12,89.38 121.3,89.38 | 134.32,87.16 134.64,87.48 137.18,87.48 137.81,86.84 v150.51,86.84 | v81.53,74.22 82.49,74.3 82.64,74.22 82.64,74.3 82.96,74.62 83.52,74.62 84.47,73.67 84.55,73.67 84.79,73.43 91.22,73.43 91.77,73.98 99.15,73.98 99.71,73.43 102.17,73.43 v103.2,73.35
/SLOT7IO  (via drill 0.6)
  Top 0.254: v94,71.92 94,75.25 94.15,75.41 v94.15,75.81 | v80.34,76.36 80.34,72.48 81.3,71.52 81.3,69.7
  Top 0.305: IC3.7 69.87,36.68 v69.94,37.31 | v77.17,37.95 78.44,39.22 80.66,39.22 80.98,39.54 80.98,44.62 81.3,44.93 81.3,69.7
  Bottom 0.254: v94.15,75.81 93.44,75.81 93.2,76.21 90.42,76.21 89.87,76.68 83.84,76.68 82.96,76.21 80.9,76.21 v80.34,76.36
  Bottom 0.305: SLOT7.1 103.2,70.97 101.93,72.24 94.95,72.24 94.63,71.92 v94,71.92 | v69.94,37.31 70.5,36.68 75.58,36.68 76.22,37.31 v77.17,37.95
/SLOTIO  (via drill 0.6)
  Top 0.254: v67.64,21.12 67.01,21.12 66.06,22.07 66.06,24.61 63.52,27.15 63.52,31.6 62.88,32.23 61.61,32.23
  Top 0.305: 61.61,32.23 60.34,33.5 60.34,38.58 61.61,39.85 66.06,39.85 66.69,40.49 IC3.4
  Bottom 0.305: JP11.2 67.96,4.29 67.96,8.1 67.33,8.74 67.33,20.8 v67.64,21.12
/SO
  Bottom 0.305: P1.A25 7,71.6 8.27,70.33 18.43,70.33 19.7,71.6 P3.A25 27.96,71.6 29.23,70.33 38.75,70.33 40.02,71.6 P4.A25 53.36,71.6 54.63,70.33 58.44,70.33 59.71,71.6 P2.A25
/WR0  (via drill 0.6)
  Top 0.254: IC6.3 111.78,86.84 112.09,86.53 112.73,86.53 113.68,87.48 118.13,87.48
  Top 0.305: 118.13,87.48 v119.08,86.53 | v121.94,84.3 127.97,84.3 v128.6,83.67 | v134.95,83.98 134.95,83.35 133.68,82.08 133.68,61.44 v134.64,60.49
  Bottom 0.305: v119.08,86.53 120.03,86.21 v121.94,84.3 | v128.6,83.67 134.64,83.67 v134.95,83.98 | v134.64,60.49 134.64,60.17
  Bottom 0.406: SLOT6.1.24 134.64,60.17 SLOT6.2.24 142.89,60.17 143.53,59.54 149.88,59.54 150.51,58.9 JP4.3
A2USER1  (via drill 0.6)
  Top 0.305: v100.82,3.9 104.55,7.63 104.55,18.34 105.98,19.77 105.98,27.95 104.87,29.06 v104.87,42.95
  Bottom 0.305: JP8.2 99.79,3.34 100.35,3.9 v100.82,3.9 | v104.87,42.95 105.5,42.95 106.85,41.76
  Bottom 0.406: SLOT3.M 90.82,43.03 92.09,41.76 97.81,41.76 99.08,43.03 SLOT5.M 105.43,43.03 105.5,42.95 106.7,41.76 106.85,41.76 113.68,41.76 114.95,43.03 SLOT7.M
B2PHI2  (via drill 0.6)
  Top 0.305: v95.27,81.76 95.27,81.13 99.08,77.32 99.08,38.58 99.71,37.95 SLOT5.O
  Bottom 0.305: P1.C29 P3.C29 18.43,81.76 19.7,83.03 27.96,83.03 29.23,81.76 P4.C29 38.12,81.76 39.39,83.03 48.28,83.03 49.55,81.76 P2.C29 59.07,81.76 60.34,83.03 67.33,83.03 70.34,80.02 77.41,80.02 78.52,81.13 94.63,81.13 v95.27,81.76
  Bottom 0.406: SLOT3.O 91.14,37.95 92.41,36.68 97.81,36.68 99.08,37.95 SLOT5.O 105.43,37.95 106.7,36.68 113.68,36.68 114.95,37.95 SLOT7.O
BA0  (via drill 0.6)
  Top 0.406: v128.29,69.06 128.29,58.03 127.49,57.24 v127.49,39.85
  Bottom 0.254: 40.02,67.79 53.36,67.79
  Bottom 0.305: P1.C23 P3.C23 18.43,66.52 19.7,67.79 27.32,67.79 28.59,66.52 P4.C23 38.75,66.52 40.02,67.79 | 53.36,67.79 54.63,66.52 P2.C23 59.07,66.52 60.34,67.79 73.68,67.79 74.31,68.43 SLOT3.2
  Bottom 0.406: SLOT3.2 80.66,68.43 81.93,69.7 93.36,69.7 94.63,68.43 SLOT5.2 97.81,68.43 99.08,69.7 106.06,69.7 107.33,68.43 SLOT7.2 113.68,68.43 114.95,69.7 120.67,69.7 121.3,69.06 v128.29,69.06 | SLOT6.1.16 v127.49,39.85 SLOT6.2.16 SLOT6.3.16
BA1  (via drill 0.6)
  Top 0.406: v129.56,66.52 129.56,65.89 128.92,65.25 128.92,57.39 128.21,56.68 128.21,42.08 128.52,41.12 v128.52,37.95
  Bottom 0.254: 40.02,65.25 42.96,65.25 43.59,65.89 52.48,65.89 52.56,65.97 53.36,65.25
  Bottom 0.305: P1.C22 P3.C22 18.43,63.98 19.7,65.25 27.32,65.25 28.59,63.98 P4.C22 38.75,63.98 40.02,65.25 | 53.36,65.25 54.63,63.98 P2.C22 59.07,63.98 60.34,65.25 73.68,65.25 74.31,65.89 SLOT3.3
  Bottom 0.406: SLOT3.3 80.66,65.89 81.93,67.16 93.36,67.16 94.63,65.89 SLOT5.3 97.81,65.89 99.08,67.16 106.06,67.16 107.33,65.89 SLOT7.3 113.68,65.89 114.95,67.16 120.67,67.16 121.3,66.52 v129.56,66.52 | SLOT6.1.15 128.84,37.31 | 128.84,37.31 SLOT6.2.15 SLOT6.3.15 | v128.52,37.95 128.84,37.31
BA2  (via drill 0.6)
  Top 0.406: v130.19,63.98 129.56,63.35 129.56,56.6 129,56.04 129,42.39 129.48,40.88 v129.48,35.17
  Bottom 0.254: 40.02,62.71 53.36,62.71
  Bottom 0.305: P1.C21 P3.C21 18.43,61.44 19.7,62.71 27.32,62.71 28.59,61.44 P4.C21 38.75,61.44 40.02,62.71 | 53.36,62.71 54.63,61.44 P2.C21 59.07,61.44 60.34,62.71 73.68,62.71 74.31,63.35 SLOT3.4
  Bottom 0.406: SLOT3.4 80.66,63.35 81.93,64.62 93.36,64.62 94.63,63.35 SLOT5.4 97.81,63.35 99.08,64.62 105.43,64.62 106.7,63.35 SLOT7.4 113.68,63.35 114.95,64.62 120.67,64.62 121.3,63.98 v130.19,63.98 | SLOT6.1.14 129.95,34.77 | 129.95,34.77 SLOT6.2.14 SLOT6.3.14 | v129.48,35.17 129.95,34.77
BA3  (via drill 0.6)
  Top 0.406: v130.67,61.44 130.19,59.54 130.19,56.12 129.71,55.49 129.71,42.63 130.35,41.12 v130.35,32.23
  Bottom 0.305: P1.C20 P3.C20 18.43,58.9 19.7,60.17 27.32,60.17 28.59,58.9 P4.C20 38.75,58.9 40.02,60.17 53.36,60.17 54.63,58.9 P2.C20 59.07,58.9 60.34,60.17 73.68,60.17 74.31,60.81 SLOT3.5
  Bottom 0.406: SLOT3.5 80.66,60.81 81.93,62.08 92.73,62.08 94,60.81 SLOT5.5 97.81,60.81 99.08,62.08 105.43,62.08 106.7,60.81 SLOT7.5 113.68,60.81 114.95,62.08 120.67,62.08 121.3,61.44 v130.67,61.44 | SLOT6.1.13 v130.35,32.23 SLOT6.2.13 SLOT6.3.13
BA4  (via drill 0.6)
  Top 0.305: IC4.1 69.87,57 v70.5,57.63
  Top 0.406: v132.89,58.9 132.89,53.19 132.97,52.63 132.97,48.19 135.27,45.57 135.27,38.58 134.48,37.63 134.48,31.12 134,30.65 v134,29.69
  Bottom 0.305: P1.C19 P3.C19 18.43,56.36 19.7,57.63 27.32,57.63 28.59,56.36 P4.C19 38.75,56.36 40.02,57.63 53.36,57.63 54.63,56.36 P2.C19 59.07,56.36 60.34,57.63 v70.5,57.63 73.68,57.63 74.31,58.27 SLOT3.6
  Bottom 0.406: SLOT3.6 80.66,58.27 81.93,59.54 92.73,59.54 94,58.27 SLOT5.6 97.81,58.27 99.08,59.54 105.43,59.54 106.7,58.27 SLOT7.6 113.68,58.27 114.95,59.54 120.03,59.54 120.67,58.9 v132.89,58.9 | SLOT6.3.12 SLOT6.2.12 v134,29.69 SLOT6.1.12
BA5  (via drill 0.6)
  Top 0.305: IC4.2 69.87,55.73 v70.5,55.09
  Top 0.406: v134,56.36 133.52,54.85 133.52,53.58 133.76,53.03 133.76,48.58 135.91,46.2 135.91,37.31 135.27,36.68 v135.27,27.15
  Bottom 0.305: P1.C18 P3.C18 18.43,53.82 19.7,55.09 27.32,55.09 28.59,53.82 P4.C18 38.75,53.82 40.02,55.09 47.96,55.09 48.35,54.7 53.04,54.7 53.99,53.82 P2.C18 59.07,53.82 60.34,55.09 v70.5,55.09 73.68,55.09 74.31,55.73 SLOT3.7
  Bottom 0.406: SLOT3.7 80.66,55.73 81.93,57 92.73,57 94,55.73 SLOT5.7 97.81,55.73 99.08,57 105.43,57 106.7,55.73 SLOT7.7 113.68,55.73 114.95,57 120.03,57 120.67,56.36 v134,56.36 | SLOT6.1.11 v135.27,27.15 SLOT6.2.11 SLOT6.3.11
BA6  (via drill 0.6)
  Top 0.305: IC4.3 69.23,54.46 v70.18,52.55
  Top 0.406: v134.48,53.82 134.48,49.38 136.54,46.84 v136.54,24.61
  Bottom 0.305: P1.C17 P3.C17 18.43,51.28 19.7,52.55 27.32,52.55 28.59,51.28 P4.C17 38.75,51.28 40.02,52.55 47.32,52.55 47.72,52.16 52.8,52.16 53.67,51.28 P2.C17 59.39,51.28 60.5,52.31 67.01,52.31 67.33,52.55 v70.18,52.55 73.68,52.55 74.31,53.19 SLOT3.8
  Bottom 0.406: SLOT3.8 80.66,53.19 81.93,54.46 92.09,54.46 93.36,53.19 SLOT5.8 97.81,53.19 99.08,54.46 105.43,54.46 106.7,53.19 SLOT7.8 113.68,53.19 114.95,54.46 120.03,54.46 120.67,53.82 v134.48,53.82 | SLOT6.1.10 v136.54,24.61 SLOT6.2.10 SLOT6.3.10
BA7  (via drill 0.6)
  Top 0.305: IC4.6 70.18,50.65 v70.82,50.01
  Top 0.406: v122.57,51.28 122.57,22.71 123.21,22.07 SLOT6.1.9
  Bottom 0.305: P2.C16 59.07,48.74 60.34,50.01 v70.82,50.01 73.68,50.01 74.31,50.65 SLOT3.9 | 40.02,50.01 47.01,50.01 47.64,49.38 51.45,49.38 52.09,50.01 52.72,50.01
  Bottom 0.406: P1.C16 P3.C16 18.43,48.74 19.7,50.01 27.32,50.01 28.59,48.74 P4.C16 38.75,48.74 40.02,50.01 | 52.72,50.01 53.99,48.74 P2.C16 | SLOT3.9 80.66,50.65 81.93,51.92 92.09,51.92 93.36,50.65 SLOT5.9 97.81,50.65 99.08,51.92 105.43,51.92 106.7,50.65 SLOT7.9 113.68,50.65 114.95,51.92 120.03,51.92 120.67,51.28 v122.57,51.28 | SLOT6.3.9 SLOT6.2.9 125.75,22.07 125.11,21.44 124.48,22.07 SLOT6.1.9
BA8  (via drill 0.6)
  Top 0.305: IC3.1 67.33,44.3 66.69,44.93 v66.69,46.84
  Top 0.406: v121.3,49.38 121.94,48.74 121.94,20.17 122.57,19.53 SLOT6.1.8
  Bottom 0.254: 46.37,48.11 52.09,48.11
  Bottom 0.305: P2.C15 59.07,46.2 60.34,47.47 66.69,47.47 | 66.69,47.47 73.68,47.47 74.31,48.11 SLOT3.10 | v66.69,46.84 66.69,47.47 | 40.02,47.47 45.74,47.47 46.37,48.11 | 52.09,48.11 52.72,47.47
  Bottom 0.406: P1.C15 P3.C15 | 17.16,46.2 P3.C15 | P3.C15 18.43,46.2 19.7,47.47 27.32,47.47 28.59,46.2 P4.C15 38.75,46.2 40.02,47.47 | 52.72,47.47 53.99,46.2 P2.C15 | SLOT3.10 80.66,48.11 81.93,49.38 90.82,49.38 92.09,48.11 SLOT5.10 98.44,48.11 99.71,49.38 105.43,49.38 106.7,48.11 SLOT7.10 113.68,48.11 114.95,49.38 v121.3,49.38 | SLOT6.1.8 SLOT6.2.8 SLOT6.3.8
BA9  (via drill 0.6)
  Top 0.305: IC3.2 69.23,43.03 70.1,43.66 v70.1,44.3
  Top 0.406: v120.67,46.84 121.3,46.2 121.3,17.63 121.94,16.99 SLOT6.1.7
  Bottom 0.254: 46.69,45.25 52.4,45.25
  Bottom 0.305: P2.C14 58.44,43.66 59.94,45.17 64.39,45.17 64.47,45.25 70.18,45.25 | 70.18,45.25 73.68,45.25 74.31,45.57 SLOT3.11 | 70.18,45.25 v70.1,44.3 | 40.02,44.93 46.37,44.93 46.69,45.25 | 52.4,45.25 52.72,44.93
  Bottom 0.406: P1.C14 P3.C14 18.43,43.66 19.7,44.93 27.32,44.93 28.59,43.66 P4.C14 38.75,43.66 40.02,44.93 | 52.72,44.93 53.99,43.66 P2.C14 | SLOT3.11 80.66,45.57 81.93,46.84 90.82,46.84 92.09,45.57 SLOT5.11 | 96.54,45.57 SLOT5.11 | SLOT5.11 97.81,45.57 99.08,46.84 105.43,46.84 106.7,45.57 SLOT7.11 113.68,45.57 114.95,46.84 v120.67,46.84 | SLOT6.3.7 SLOT6.2.7 SLOT6.1.7
BA10  (via drill 0.6)
  Top 0.305: IC3.3 v70.1,42.39
  Top 0.406: v120.03,44.3 120.67,43.66 120.67,15.72 121.94,14.45 SLOT6.1.6
  Bottom 0.305: P2.C13 60.18,41.12 61.45,42.39 63.83,42.39 64.15,42.71 69.79,42.71 v70.1,42.39 73.68,42.39 74.31,43.03 SLOT3.12 | 52.72,42.39 40.02,42.39
  Bottom 0.406: P1.C13 P3.C13 18.43,41.12 19.7,42.39 27.32,42.39 28.59,41.12 P4.C13 38.75,41.12 40.02,42.39 | 52.72,42.39 53.99,41.12 P2.C13 | SLOT3.12 80.66,43.03 81.93,44.3 90.82,44.3 92.09,43.03 SLOT5.12 97.81,43.03 99.08,44.3 105.43,44.3 106.7,43.03 SLOT7.12 113.68,43.03 114.95,44.3 v120.03,44.3 | SLOT6.1.6 SLOT6.2.6 SLOT6.3.6
BA11  (via drill 0.6)
  Top 0.305: IC5.1 67.01,31.6 65.74,32.87 v65.74,38.66
  Top 0.406: v119.4,41.76 120.03,41.12 120.03,14.45 122.57,11.91 SLOT6.1.5
  Bottom 0.254: v65.74,38.66 66.06,39.54 66.37,39.85
  Bottom 0.305: P2.C12 59.47,38.58 60.74,39.85 66.37,39.85 73.68,39.85 74.31,40.49 SLOT3.13 | 40.02,39.85 43.2,39.85 43.83,39.22 53.36,39.22
  Bottom 0.406: P1.C12 P3.C12 18.43,38.58 19.7,39.85 27.32,39.85 28.59,38.58 P4.C12 38.75,38.58 40.02,39.85 | 53.36,39.22 53.99,38.58 P2.C12 | SLOT3.13 80.66,40.49 81.93,41.76 90.82,41.76 92.09,40.49 SLOT5.13 97.81,40.49 99.08,41.76 105.43,41.76 106.7,40.49 SLOT7.13 113.68,40.49 114.95,41.76 v119.4,41.76 | SLOT6.3.5 SLOT6.2.5 SLOT6.1.5
BA12  (via drill 0.6)
  Top 0.406: v118.76,39.22 119.4,38.58 119.4,11.91 121.94,9.37 SLOT6.1.4 | IC5.2 66.06,30.33 66.06,31.6 64.79,32.55 64.79,35.09 64.15,36.04 v64.15,36.36
  Bottom 0.305: P2.C11 59.07,36.04 60.34,37.31 63.2,37.31 64.63,37.31 64.94,37.63 66.93,37.63 68.52,39.22 74.07,39.22 74.95,39.85 76.85,39.85 SLOT3.14 | 52.72,37.31 40.02,37.31
  Bottom 0.406: P1.C11 P3.C11 18.43,36.04 19.7,37.31 27.32,37.31 28.59,36.04 P4.C11 38.75,36.04 40.02,37.31 | 52.72,37.31 53.99,36.04 P2.C11 | SLOT3.14 80.66,37.95 81.93,39.22 90.82,39.22 92.09,37.95 SLOT5.14 97.81,37.95 99.08,39.22 105.43,39.22 106.7,37.95 SLOT7.14 113.68,37.95 114.95,39.22 v118.76,39.22 | SLOT6.1.4 127.02,9.37 128.29,10.64 134,10.64 135.27,9.37 SLOT6.2.4 SLOT6.3.4 | v64.15,36.36 63.2,37.31
BA13  (via drill 0.6)
  Top 0.254: IC5.4 64.79,27.79 64.15,28.42 64.15,31.92 63.83,32.23 v63.83,34.77
  Top 0.406: SLOT6.2.3 137.18,6.83 133.37,10.64 128.29,10.64 127.02,9.37 127.02,8.74 SLOT6.1.3 122.57,6.83 118.76,10.64 118.76,36.68 v118.13,36.68
  Bottom 0.305: 40.02,34.77 52.72,34.77
  Bottom 0.406: P1.C10 P3.C10 18.43,33.5 19.7,34.77 27.32,34.77 28.59,33.5 P4.C10 38.75,33.5 40.02,34.77 | 52.72,34.77 53.99,33.5 P2.C10 59.07,33.5 60.34,34.77 v63.83,34.77 73.68,34.77 74.31,35.41 SLOT3.15 80.66,35.41 81.93,36.68 91.46,36.68 92.73,35.41 SLOT5.15 97.81,35.41 99.08,36.68 105.43,36.68 106.7,35.41 SLOT7.15 113.68,35.41 114.95,36.68 v118.13,36.68 | SLOT6.3.3 SLOT6.2.3
BA14  (via drill 0.6)
  Top 0.406: SLOT6.1.2 127.65,1.75 134,1.75 136.54,4.29 SLOT6.2.2 142.89,4.29 144.16,5.56 v144.16,33.5 | IC5.3 66.06,29.06 65.42,29.69 v65.1,29.69
  Bottom 0.254: P4.C9 38.75,30.96 40.02,32.23 52.72,32.23 53.99,30.96 P2.C9
  Bottom 0.406: P1.C9 P3.C9 18.43,30.96 19.7,32.23 27.32,32.23 28.59,30.96 P4.C9 | P2.C9 59.07,30.96 60.34,32.23 65.1,32.23 | SLOT6.3.2 SLOT6.2.2 | v144.16,33.5 139.08,33.5 138.45,34.14 130.83,34.14 130.19,33.5 121.3,33.5 120.67,34.14 114.95,34.14 113.68,32.87 SLOT7.16 106.7,32.87 105.43,34.14 99.08,34.14 97.81,32.87 SLOT5.16 93.36,32.87 92.09,34.14 81.93,34.14 80.66,32.87 SLOT3.16 75.26,32.87 74.63,32.23 65.1,32.23 | v65.1,29.69 65.1,32.23
BA15  (via drill 0.6)
  Top 0.254: v82.8,31.44 83.28,31.44 83.6,31.6 85.34,31.6 85.74,31.99 86.45,31.99 v86.69,31.76 | IC5.6 67.01,25.25 66.37,25.88 66.37,26.83 66.69,27.15 70.18,27.15 v70.18,29.69
  Top 0.406: v145.11,30.96 145.11,27.47 145.43,27.15 145.43,3.66 143.53,1.75 SLOT6.2.1
  Bottom 0.254: P4.C8 37.96,28.42 39.23,29.69 | SLOT3.17 80.9,30.33 v82.8,31.44 | v86.69,31.76 89.63,29.93 93.92,29.93 94.31,30.33 SLOT5.17 | 52.72,29.69 53.99,28.42 P2.C8
  Bottom 0.305: 39.23,29.69 52.72,29.69
  Bottom 0.406: P1.C8 P3.C8 18.43,28.42 19.7,29.69 27.32,29.69 28.59,28.42 P4.C8 | SLOT5.17 97.81,30.33 99.08,31.6 105.43,31.6 106.7,30.33 SLOT7.17 113.68,30.33 114.95,31.6 120.67,31.6 121.3,30.96 133.37,30.96 134,31.6 137.18,31.6 137.81,30.96 v145.11,30.96 | SLOT6.3.1 SLOT6.2.1 SLOT6.1.1 | P2.C8 59.07,28.42 60.34,29.69 62.56,29.69 63.52,28.74 69.23,28.74 v70.18,29.69 73.99,29.69 74.63,30.33 SLOT3.17
BA16  (via drill 0.6)
  Top 0.254: IC7.3 28.27,25.25 28.59,25.56 v28.91,25.56
  Top 0.305: 64.15,24.61 64.79,23.98 64.79,22.07 65.42,21.44 65.42,20.8
  Top 0.406: IC2.1 67.33,18.9 65.42,20.8 | 64.15,24.61 58.44,24.61 P2.C7
  Bottom 0.254: P4.C7 39.39,25.88 40.42,26.91 46.13,26.91 46.37,26.68 50.1,26.68 50.58,27.15 52.72,27.15 53.99,25.88 P2.C7 | v28.91,25.56 28.59,25.88
  Bottom 0.406: P1.C7 P3.C7 18.43,25.88 19.7,27.15 27.32,27.15 28.59,25.88 P4.C7
BA17  (via drill 0.6)
  Top 0.254: IC7.11 30.18,23.98 v29.86,23.66
  Top 0.406: IC2.2 66.69,17.63 64.15,20.17 64.15,21.44 63.52,22.07 58.44,22.07 P2.C6
  Bottom 0.254: P4.C6 39.07,23.34 40.34,24.61 52.4,24.61 53.67,23.34 P2.C6 | v29.86,23.66 29.54,23.34
  Bottom 0.406: P1.C6 P3.C6 18.43,23.34 19.7,24.61 27.32,24.61 28.59,23.34 29.54,23.34 P4.C6
BA18  (via drill 0.6)
  Top 0.254: IC7.6 28.91,21.44 v29.23,21.12
  Top 0.406: IC2.3 66.69,16.36 63.52,19.53 58.44,19.53 P2.C5
  Bottom 0.254: 40.02,22.07 52.09,22.07 53.36,20.8 P2.C5 | v29.23,21.12 29.23,20.8
  Bottom 0.406: P1.C5 P3.C5 18.43,20.8 19.7,22.07 27.32,22.07 28.59,20.8 29.23,20.8 P4.C5 38.75,20.8 40.02,22.07
BA19  (via drill 0.6)
  Top 0.254: IC7.8 30.81,20.17 30.18,19.53 v30.18,18.58
  Top 0.406: IC2.4 66.06,15.09 64.15,16.99 58.44,16.99 P2.C4
  Bottom 0.254: P2.C4 53.67,18.26 52.4,19.53 40.02,19.53 | v30.18,18.58 30.18,18.26
  Bottom 0.406: P1.C4 P3.C4 18.43,18.26 19.7,19.53 27.32,19.53 28.59,18.26 30.18,18.26 P4.C4 38.75,18.26 40.02,19.53
BD0  (via drill 0.6)
  Top 0.305: P2.A22 64.15,65.89 v64.15,66.52
  Bottom 0.305: P1.A22 7,63.98 8.27,62.71 18.43,62.71 19.7,63.98 P3.A22 27.32,63.98 28.59,62.71 38.75,62.71 40.02,63.98 P4.A22 53.36,63.98 54.63,62.71 59.07,62.71 60.34,63.98 P2.A22 | v64.15,66.52 73.68,66.52 74.31,67.16 80.66,67.16 81.93,68.43 SLOT3.B 93.36,68.43
  Bottom 0.406: 93.36,68.43 94.63,67.16 97.81,67.16 99.08,68.43 SLOT5.B 106.06,68.43 107.33,67.16 113.68,67.16 114.95,68.43 SLOT7.B 120.67,68.43 121.3,67.79 SLOT6.1.27 SLOT6.2.27 SLOT6.3.27
BD1  (via drill 0.6)
  Top 0.305: P2.A21 64.15,63.35 v64.15,63.98
  Top 0.406: v114.87,72.79 114.95,72.56 114.95,66.52 115.59,65.89 SLOT7.C
  Bottom 0.305: P1.A21 7,61.44 8.27,60.17 18.43,60.17 19.7,61.44 P3.A21 27.32,61.44 28.59,60.17 38.75,60.17 40.02,61.44 P4.A21 53.36,61.44 54.63,60.17 59.07,60.17 60.34,61.44 P2.A21 | v64.15,63.98 73.68,63.98 74.31,64.62 80.66,64.62 81.93,65.89 SLOT3.C 93.36,65.89
  Bottom 0.406: 93.36,65.89 94.63,64.62 97.81,64.62 99.08,65.89 SLOT5.C 105.43,65.89 106.7,64.62 113.68,64.62 114.95,65.89 SLOT7.C | SLOT6.3.28 SLOT6.2.28 SLOT6.1.28 123.84,70.33 120.98,72.79 v114.87,72.79
BD2  (via drill 0.6)
  Top 0.305: P2.A20 64.15,60.81 v64.15,61.44
  Top 0.406: v114.32,74.54 113.68,74.14 113.68,63.98 114.32,63.35 SLOT7.D
  Bottom 0.305: P1.A20 7,58.9 8.27,57.63 18.43,57.63 19.7,58.9 P3.A20 27.32,58.9 28.59,57.63 38.75,57.63 40.02,58.9 P4.A20 53.36,58.9 54.63,57.63 59.07,57.63 60.34,58.9 P2.A20 | v64.15,61.44 73.68,61.44 74.31,62.08 80.66,62.08 81.93,63.35 SLOT3.D 93.36,63.35
  Bottom 0.406: 93.36,63.35 94.63,62.08 97.81,62.08 99.08,63.35 SLOT5.D 105.43,63.35 106.7,62.08 113.68,62.08 114.95,63.35 SLOT7.D | SLOT6.3.29 SLOT6.2.29 SLOT6.1.29 123.52,72.87 121.78,74.22 116.06,74.22 115.51,74.54 v114.32,74.54
BD3  (via drill 0.6)
  Top 0.305: P2.A19 64.15,58.27 v64.15,58.9
  Top 0.406: SLOT6.1.30 122.57,75.41 121.94,74.78 121.94,60.81 v122.57,60.17
  Bottom 0.305: P1.A19 7,56.36 8.27,55.09 18.43,55.09 19.7,56.36 P3.A19 27.32,56.36 28.59,55.09 38.75,55.09 40.02,56.36 P4.A19 47.24,56.36 47.88,57 52.09,57 53.99,55.09 59.07,55.09 60.34,56.36 P2.A19 | v64.15,58.9 73.68,58.9 74.31,59.54 80.66,59.54 81.93,60.81 SLOT3.E 92.73,60.81
  Bottom 0.406: 92.73,60.81 94,59.54 97.81,59.54 99.08,60.81 SLOT5.E 105.43,60.81 106.7,59.54 113.68,59.54 114.95,60.81 SLOT7.E 120.03,60.81 120.67,60.17 v122.57,60.17 | SLOT6.1.30 126.7,75.41 127.33,74.78 139.08,74.78 139.64,75.33 SLOT6.2.30 SLOT6.3.30
BD4  (via drill 0.6)
  Top 0.305: P2.A18 64.15,55.73 v64.15,56.36
  Top 0.406: SLOT6.1.31 124.4,77.95 123.36,78.98 122.33,78.98 121.3,77.32 121.3,58.27 v121.94,57.63
  Bottom 0.305: P1.A18 7,53.82 8.27,52.55 18.43,52.55 19.7,53.82 P3.A18 27.32,53.82 28.59,52.55 38.75,52.55 40.02,53.82 P4.A18 47.64,53.82 48.04,54.22 52.64,54.22 54.15,52.79 58.91,52.79 60.02,53.82 P2.A18 | v64.15,56.36 73.68,56.36 74.31,57 80.66,57 81.93,58.27 SLOT3.F 92.73,58.27
  Bottom 0.406: 92.73,58.27 94,57 97.81,57 99.08,58.27 SLOT5.F 105.43,58.27 106.7,57 113.68,57 114.95,58.27 SLOT7.F 120.03,58.27 120.67,57.63 v121.94,57.63 | SLOT6.1.31 128.6,77.95 128.92,77.64 133.05,77.64 133.37,77.95 SLOT6.2.31 SLOT6.3.31
BD5  (via drill 0.6)
  Top 0.305: P2.A17 64.15,53.19 v64.15,53.82
  Top 0.406: SLOT6.1.32 122.57,80.49 120.67,79.86 120.67,55.73 v121.94,55.09
  Bottom 0.305: P1.A17 7,51.28 8.27,50.01 18.43,50.01 19.7,51.28 P3.A17 27.32,51.28 28.59,50.01 38.75,50.01 40.02,51.28 P4.A17 47.64,51.28 48.12,51.68 52.24,51.68 53.99,50.01 59.07,50.01 60.34,51.28 P2.A17 | v64.15,53.82 65.42,53.82 65.74,54.14 67.64,54.14 67.96,53.82 73.68,53.82 74.31,54.46 80.66,54.46 81.93,55.73 SLOT3.G 92.73,55.73
  Bottom 0.406: 92.73,55.73 94,54.46 97.81,54.46 99.08,55.73 SLOT5.G 105.43,55.73 106.7,54.46 113.68,54.46 114.95,55.73 SLOT7.G 119.4,55.73 120.03,55.09 v121.94,55.09 | SLOT6.1.32 SLOT6.2.32 SLOT6.3.32
BD6  (via drill 0.6)
  Top 0.305: P2.A16 64.15,50.65 v64.15,51.28
  Top 0.406: SLOT6.1.33 121.3,83.03 120.03,82.4 120.03,53.51 120.9,52.63 v120.9,52.55
  Bottom 0.254: P4.A16 52.72,48.74
  Bottom 0.305: v64.15,51.28 73.68,51.28 74.31,51.92 80.66,51.92 81.93,53.19 SLOT3.H 92.09,53.19
  Bottom 0.406: P1.A16 7,48.74 8.27,47.47 18.43,47.47 19.7,48.74 P3.A16 27.32,48.74 28.59,47.47 38.75,47.47 40.02,48.74 P4.A16 | 52.72,48.74 53.99,47.47 59.07,47.47 60.34,48.74 P2.A16 | 92.09,53.19 93.36,51.92 97.81,51.92 99.08,53.19 SLOT5.H 105.43,53.19 106.7,51.92 113.68,51.92 114.95,53.19 SLOT7.H 120.03,53.19 v120.9,52.55 | SLOT6.1.33 127.65,83.03 127.97,82.72 136.22,82.72 136.54,83.03 SLOT6.2.33 SLOT6.3.33
BD7  (via drill 0.6)
  Top 0.305: P2.A15 64.15,48.11 v64.15,48.74
  Top 0.406: SLOT6.1.34 121.62,85.57 120.98,84.94 119.71,84.94 119.4,84.62 v119.4,50.65
  Bottom 0.254: 46.69,46.2 47.16,45.73 53.2,45.73 53.99,44.93
  Bottom 0.305: 92.09,50.65 SLOT3.J 81.93,50.65 80.66,49.38 74.31,49.38 73.68,48.74 v64.15,48.74
  Bottom 0.406: P1.A15 7,46.2 8.27,44.93 18.43,44.93 19.7,46.2 P3.A15 27.32,46.2 28.59,44.93 38.75,44.93 40.02,46.2 P4.A15 46.69,46.2 | 53.99,44.93 58.75,44.93 60.02,46.2 P2.A15 | 92.09,50.65 93.36,49.38 97.81,49.38 99.08,50.65 SLOT5.J 105.43,50.65 106.7,49.38 113.68,49.38 114.95,50.65 SLOT7.J v119.4,50.65 | SLOT6.1.34 126.7,85.57 127.02,85.25 132.25,85.25 132.57,85.57 134.95,85.57 135.59,84.94 136.86,84.94 137.49,85.57 SLOT6.2.34 SLOT6.3.34
BPHI0  (via drill 0.6)
  Top 0.305: v134.64,79.22 134.64,73.19 134.32,72.87 134.32,69.38 134.64,69.06 134.64,62.4 135.91,61.12 135.91,57.63 136.54,57 v136.54,52.55
  Bottom 0.254: 120.98,79.54 132.1,79.54
  Bottom 0.305: P1.C28 P3.C28 18.43,79.22 19.7,80.49 27.96,80.49 29.23,79.22 P4.C28 38.12,79.22 39.39,80.49 48.28,80.49 49.55,79.22 P2.C28 59.07,79.22 60.34,80.49 66.45,80.49 67.48,79.46 77.64,79.46 78.6,80.41 97.81,80.49 99.08,79.22 101.62,79.22 102.25,78.59 102.25,78.51 102.96,77.79 106.93,77.79 107.73,78.59 108.92,78.59 109.55,79.22 113.76,79.22 114.47,79.94 120.35,79.94 120.43,79.86 120.98,79.54 | 132.1,79.54 132.41,79.22 v134.64,79.22
  Bottom 0.406: SLOT6.1.21 125.75,52.55 127.02,51.28 135.27,51.28 v136.54,52.55 SLOT6.2.21 142.89,52.55 143.53,51.92 152.42,51.92 153.05,52.55 SLOT6.3.21
BPHI1  (via drill 0.6)
  Top 0.305: v92.09,79.54 92.09,74.54 91.53,73.98 91.53,69.94 92.01,69.46 92.09,40.49 v92.73,39.38 | v130.67,43.66 v130.67,52.55
  Bottom 0.305: P1.C27 P3.C27 18.43,76.68 19.7,77.95 27.96,77.95 29.23,76.68 P4.C27 38.75,76.68 40.02,77.95 53.36,77.95 54.63,76.68 P2.C27 58.44,76.68 59.71,77.95 63.52,77.95 64.63,78.98 77.88,78.98 78.76,79.86 90.19,79.86 v92.09,79.54 | v92.73,39.38 92.73,39.22 | SLOT7.N 120.03,40.49 123.21,43.66 v130.67,43.66 | v130.67,52.55 134.64,52.55 135.91,53.82 JP3.1
  Bottom 0.406: SLOT3.N 90.82,40.49 92.09,39.22 92.73,39.22 97.81,39.22 99.08,40.49 SLOT5.N 105.43,40.49 106.7,39.22 113.68,39.22 114.95,40.49 SLOT7.N
BPHI2  (via drill 0.6)
  Top 0.254: IC6.2 109.24,88.11 108.6,87.48 108.6,86.21 109.24,85.57 IC6.4
  Top 0.305: SLOT5.L 101.62,45.57 103.52,47.47 103.6,69.94 104.16,70.49 104.16,75.02 103.52,75.49 v103.52,76.29 v103.44,80.1 | 109.24,85.57 108.92,85.57 v108.6,85.25
  Bottom 0.305: P1.C26 P3.C26 18.43,74.14 19.7,75.41 27.96,75.41 29.23,74.14 P4.C26 38.75,74.14 40.02,75.41 53.36,75.41 54.63,74.14 P2.C26 58.44,74.14 59.71,75.41 64.15,75.41 66.77,77.87 78.52,77.87 79.23,78.59 90.82,78.59 91.46,77.95 100.58,77.95 101.22,77.32 101.77,77.32 102.81,76.29 v103.52,76.29 | v108.6,85.25 108.6,83.43 108.92,83.11 108.92,80.81 108.2,80.1 v103.44,80.1
  Bottom 0.406: SLOT3.L 90.82,45.57 92.09,44.3 97.81,44.3 99.08,45.57 SLOT5.L 105.43,45.57 106.7,44.3 113.68,44.3 114.95,45.57 SLOT7.L 121.94,45.57 122.57,46.2 144.16,46.2 JP2.1
COLORREF
  Bottom 0.406: SLOT3.Q 84.87,32.87 85.42,33.42 91.85,33.42 93.68,31.6 97.81,31.6 99.08,32.87 SLOT5.Q 105.43,32.87 106.7,31.6 113.68,31.6 114.95,32.87 SLOT7.Q
GND  (via drill 0.6)
  Top 0.254: 66.06,50.65 66.69,50.01 69.87,50.01 69.87,48.74 | IC8.5 44.78,32.87 44.15,33.5 44.15,34.45 44.47,34.77 47.96,34.77 48.59,35.41 48.59,36.36 48.28,36.68 IC8.2 | IC7.7 24.46,20.17 | 24.15,22.71 23.83,23.03 | 33.99,25.25 34.31,24.93 34.31,21.76 33.99,21.44 34.31,21.12 34.31,19.22 32.72,17.63 31.45,17.63 28.91,15.09 C1.- | 24.78,30.65 23.19,32.23 | 18.43,17.31 18.11,16.99 | IC4.5 66.06,51.92 | 109.24,81.76 109.24,80.1 109.24,79.22 109.87,78.59 | C11.2 102.04,94.56 102.57,95.1 JP1.1 JP1.2 JP1.3 111.46,95.1 112.73,93.83 112.73,92.03 C12.2 | J1.2 86.38,84.62 | 101.62,93.19 101.93,93.19 | 70.07,35.41 70.29,35.19 | IC3.5 70.82,39.22 71.06,39.54
  Top 0.305: 67.96,48.01 IC4.8 69.23,48.11 | C9.2 70.29,45.78 | 66.06,50.65 66.06,51.92 65.1,52.55 65.1,53.82 66.06,54.77 66.06,57.63 67.33,58.9 C10.2 70.29,72.02 | 70.29,72.02 v70.5,72.24 | C21.- 74.95,72.24 | 70.29,72.02 68.18,72.02 67.33,72.87 60.98,72.87 60.34,73.51 60.34,77.32 P2.A28 P2.A29 P2.A30 P2.A31 P2.A32 | IC1.7 101.62,81.76 | 109.24,81.76 IC6.7 | IC8.7 47.96,30.33 48.28,30.65 48.28,32.55 47.96,32.87 IC8.5 | 69.55,20.8 C7.2 | SLOT3.Z 84.15,10.01 | v44.78,40.17 44.47,39.54 44.47,37 44.78,36.68 45.02,36.68 IC8.2
  Top 0.406: P3.A1 25.42,10.64 26.69,11.91 C3.- 32.4,10.64 P4.C1 | C1.- 25.42,15.09 23.51,16.99 18.11,16.99 14.62,16.99 13.99,16.36 13.99,13.18 | 13.99,13.18 P3.C1 | P1.C1 11.45,10.64 13.99,13.18 | IC2.8 68.06,9.91 | v44.78,40.17 43.59,40.17 43.2,39.77 39.15,39.77 39.07,39.85 | 45.02,36.68 43.83,36.68 43.2,37.31 39.46,37.31 39.39,37.23
  Top 0.61: IC2.8 66.69,10.01 66.06,10.64 P2.A1 | C7.2 70.29,14.03 v70.5,13.82 | C9.2 68.6,46.2 67.96,46.84 67.96,48.01 | 70.29,45.78 71.14,44.93 71.14,41.92 70.58,41.36 70.58,40.01 71.06,39.54 71.06,36.04 70.29,35.19 C8.2 70.29,31.81 71.37,30.65 71.37,25.88 70.42,24.69 70.34,23.26 69.87,22.71 IC5.8 68.06,22.29 69.55,20.8 | 69.87,48.74 69.23,48.11 | 84.15,10.01 82.88,8.74 78.2,8.74 77.72,9.05 70.21,9.05 IC2.8 | C2.2 v47.32,40.17 | IC7.7 24.15,20.17 23.83,20.49 23.83,22.39 24.15,22.71 IC7.5 | 23.83,23.03 23.83,26.2 24.15,26.52 | 24.15,26.52 IC7.2 | IC7.9 33.99,21.44 | 33.99,25.25 IC7.12 | C16.2 24.78,30.65 23.83,29.69 23.83,26.83 24.15,26.52 | 23.19,32.23 20.34,32.23 18.43,30.33 18.43,17.31 | IC1.7 v97.81,81.76 | IC3.8 70.07,35.41 | 34.31,24.93 35.26,24.93 35.58,24.61 38.12,24.61 | 38.12,24.61 40.66,22.07 43.99,22.07 44.62,22.71 44.62,27.63 46.37,29.37 46.37,30.23 IC8.7 | v70.5,10.64 70.5,10.4 70.1,10.01 IC2.8 | 44.54,64.94 43.59,64.94 43.35,65.17 39.31,65.17 39.31,78.19 40.34,79.22 P4.A28 | 90.58,33.03 92.25,33.03 93.44,31.84 93.44,29.69 94.07,29.06 97.65,29.06 98.12,28.58 99.23,28.58 99.71,29.06 102.57,29.06 | 102.57,29.06 v103.68,30.17 | 102.57,29.06 102.73,29.06 104.55,27.23 v104.55,24.29 104.55,21.52 103.04,20.01 103.04,12.07 SLOT5.Z | 109.24,80.1 v111.46,80.1 111.46,78.67 v112.49,77.64 | v122.81,77.64 123.21,77.24 | 38.12,24.61 38.99,24.61 40.02,25.64 40.02,29.3 39.39,29.93 39.39,30.8
  Top 0.914: v133.37,13.18 v133.37,23.42 133.37,27.15 132.73,27.79 132.73,30.96 133.37,31.6 C15.- | v100.98,6.2 SLOT5.Z | C6.- 88.28,4.93 87.65,5.56 87.65,9.37 88.28,10.01 C13.- | 74.95,72.24 76.22,73.51 76.22,79.86 v74.79,81.37 | P3.A28 P3.A29 P3.A30 P3.A31 P3.A32 | P4.A28 P4.A29 P4.A30 P4.A31 P4.A32 | J1.2 86.38,79.22 88.52,77.64 88.52,73.19 88.92,72.24 C19.- 90.19,71.36 90.58,70.97 90.58,33.03 | 109.87,78.59 v109.87,72.87 | 86.38,84.62 91.46,89.7 97.88,89.7 101.62,93.19 | 123.21,77.24 123.76,76.68 126.94,76.68 v127.97,75.65 | v143.6,76.68 143.6,71.36 144.64,70.33 144.64,67.71 143.92,67 143.92,63.35 142.57,62 142.57,44.54 SLOT6.2.17 | C20.- 106.7,66.36 107.65,65.41 107.65,29.77 v107.09,29.22
  Bottom 0.305: J1.3 J1.2 | P4.A32 42.64,89.38 43.27,90.02 53.43,90.02 54.07,89.38 P2.C32 61.61,89.38 62.25,88.75 P2.A32
  Bottom 0.61: SLOT5.Z 99.08,10.01 97.81,11.28 92.73,11.28 91.46,10.01 C13.- | v70.5,13.82 v70.5,10.64 | v47.32,40.17 v44.78,40.17 | J1.2 88.92,81.76 93.68,81.76 94.95,83.03 96.22,83.03 97.17,81.76 v97.81,81.76 97.96,81.76 99.63,80.1 101.93,80.1 103.28,78.75 106.85,78.75 107.41,79.3 108.52,79.3 109.31,80.1 v111.46,80.1 | P3.A31 28.03,86.84 29.38,85.57 38.43,85.57 39.78,86.84 42,86.84 | P3.A29 27.96,81.76 29.23,80.49 38.19,80.49 39.46,81.76 P4.A29 | P3.A28 28.11,79.22 29.38,77.95 38.43,77.95 39.7,79.22 P4.A28 | P3.A30 27.8,84.3 28.99,83.03 38.04,83.03 39.31,84.22 41.93,84.22 42,84.3 | v44.47,64.94 50.34,64.94 v50.42,65.01 | v103.68,30.17 105.58,30.17 106.54,29.22 v107.09,29.22 107.17,29.22 | 122.73,77.64 v122.81,77.64 | v104.55,24.29 110.35,24.29 110.58,23.98 122.65,23.98 123.28,23.42 v133.37,23.42
  Bottom 0.914: P2.A1 P2.C1 52.72,6.2 C5.- 48.91,6.2 47.64,7.47 C4.- 44.47,10.01 43.83,10.64 P4.A1 P4.C1 | P3.C1 P3.A1 | 10.81,5.56 P1.C1 | v133.37,13.18 123.21,13.18 120.03,10.01 SLOT7.Z 111.78,4.93 C14.- 102.25,4.93 v100.98,6.2 | SLOT6.3.17 151.78,42.39 150.51,41.12 C18.- 144.16,41.12 144.16,41.76 143.53,42.39 SLOT6.2.17 137.18,42.39 135.91,41.12 C15.- 131.46,41.12 130.19,42.39 SLOT6.1.17 | SLOT3.Z C13.- | v70.5,72.24 C21.- | v74.79,81.37 77.49,81.37 78.2,82.08 78.91,82.08 J1.3 | P1.A28 P1.A29 P1.A30 P1.A31 P1.A32 P1.C32 P3.C32 P3.A32 23.83,89.38 24.15,89.06 34.31,89.06 34.62,89.38 P4.C32 P4.A32 | v109.87,72.87 C20.- | v112.49,77.64 122.73,77.64 | v127.97,75.65 137.73,75.65 138.84,76.68 v143.6,76.68
  pour Top (isolate 1.27): 1.92,98.27 158.13,98.27 158.13,1.75 1.92,1.75
  pour Top (isolate 1.016): 1.92,98.27 158.13,98.27 158.13,61.44 158.13,1.75 1.92,1.75 1.92,11.91
I2SCL
  Bottom 0.406: P1.A14 7,43.66 8.27,42.39 18.43,42.39 19.7,43.66 P3.A14 27.32,43.66 28.59,42.39 38.75,42.39 40.02,43.66 P4.A14 47.01,43.66 47.64,43.03 51.45,43.03 52.09,43.66 52.72,43.66 53.99,42.39 60.34,42.39 61.61,43.66 P2.A14
I2SDA
  Bottom 0.406: P1.A13 7,41.12 8.27,39.85 18.43,39.85 19.7,41.12 P3.A13 27.32,41.12 28.59,39.85 38.75,39.85 40.02,41.12 P4.A13 42.88,41.12 43.51,41.76 52.09,41.76 53.99,39.85 59.86,39.85 61.13,41.12 P2.A13
N$1  (via drill 0.6)
  Top 0.406: v152.42,49.38 148.61,49.38 147.97,48.74 JP2.2
  Bottom 0.406: SLOT6.3.19 154.32,47.47 v152.42,49.38
N$2
  Top 0.406: JP3.2 147.97,54.46 149.24,55.73 152.42,55.73 154.32,57.63 SLOT6.3.23
N$3  (via drill 0.6)
  Top 0.254: 48.91,34.14 49.23,34.45 49.23,37.63 48.91,37.95 IC8.1 | IC7.4 28.91,23.98 | 28.91,23.98 29.86,24.93 29.86,26.52 | 29.86,26.52 IC7.13 34.94,26.52 35.26,26.83 35.5,27.15 37.8,27.15 | IC7.1 29.23,27.79 29.86,27.15 29.86,26.52 | IC7.10 29.23,22.71 28.91,23.03 28.91,23.98 | 48.95,27.75 49.55,28.42 49.55,33.5 49.23,33.82
  Top 0.305: IC8.4 48.91,34.14 49.23,33.82 | 37.8,27.15 v38.83,26.76 | v47.96,27.71 48.12,27.71 48.95,27.75
  Top 0.406: IC8.1 46.47,39.12 46.05,39.54 46.05,40.8 44.62,41.36 44.57,57.53 46.53,59.46 46.37,86.84 49.55,90.02 JP9.2
  Bottom 0.254: 39.54,27.39 47.72,27.39
  Bottom 0.305: v38.83,26.76 39.54,27.39 | 47.72,27.39 v47.96,27.71
N$4
  Top 0.406: JP4.2 147.97,58.27 149.24,59.54 152.42,59.54 153.05,60.17 SLOT6.3.24
N$5  (via drill 0.6)
  Top 0.254: IC1.8 107.33,81.76 107.81,82.24 v107.81,82.56 | v112.41,87.48 112.73,87.48 113.36,88.11 IC6.13
  Bottom 0.254: v107.81,82.56 107.81,84.54 107.57,84.86 107.57,85.57 109.47,87.48 v112.41,87.48
N$6
  Top 0.406: JP5.2 147.97,62.08 149.24,63.35 152.42,63.35 153.05,62.71 SLOT6.3.25
N$7
  Bottom 0.406: JP6.2 147.97,65.89 149.24,67.16 151.78,67.16 153.69,65.25 SLOT6.3.26
N$8  (via drill 0.6)
  Top 0.305: IC1.6 101.62,83.03 v101.93,83.35 | v102.57,87.79 103.2,87.79 104.16,88.75 107.33,88.75 107.97,89.38 IC6.1
  Bottom 0.305: v101.93,83.35 100.66,83.35 99.71,84.3 99.71,86.53 100.66,87.79 v102.57,87.79
N$9
  Top 0.254: IC1.10 107.65,84.3 108.28,83.67 113.68,83.67 114.32,84.3 IC6.10
N$10
  Bottom 0.406: JP7.2 147.97,92.56 149.24,91.29 151.15,91.29 153.05,93.19 SLOT6.3.37
N$11